# Altium schematic sheet EthIO_02B_MCU_PA_PB.SchDoc
size A4; SheetNumber: 4; SheetTotal: 7
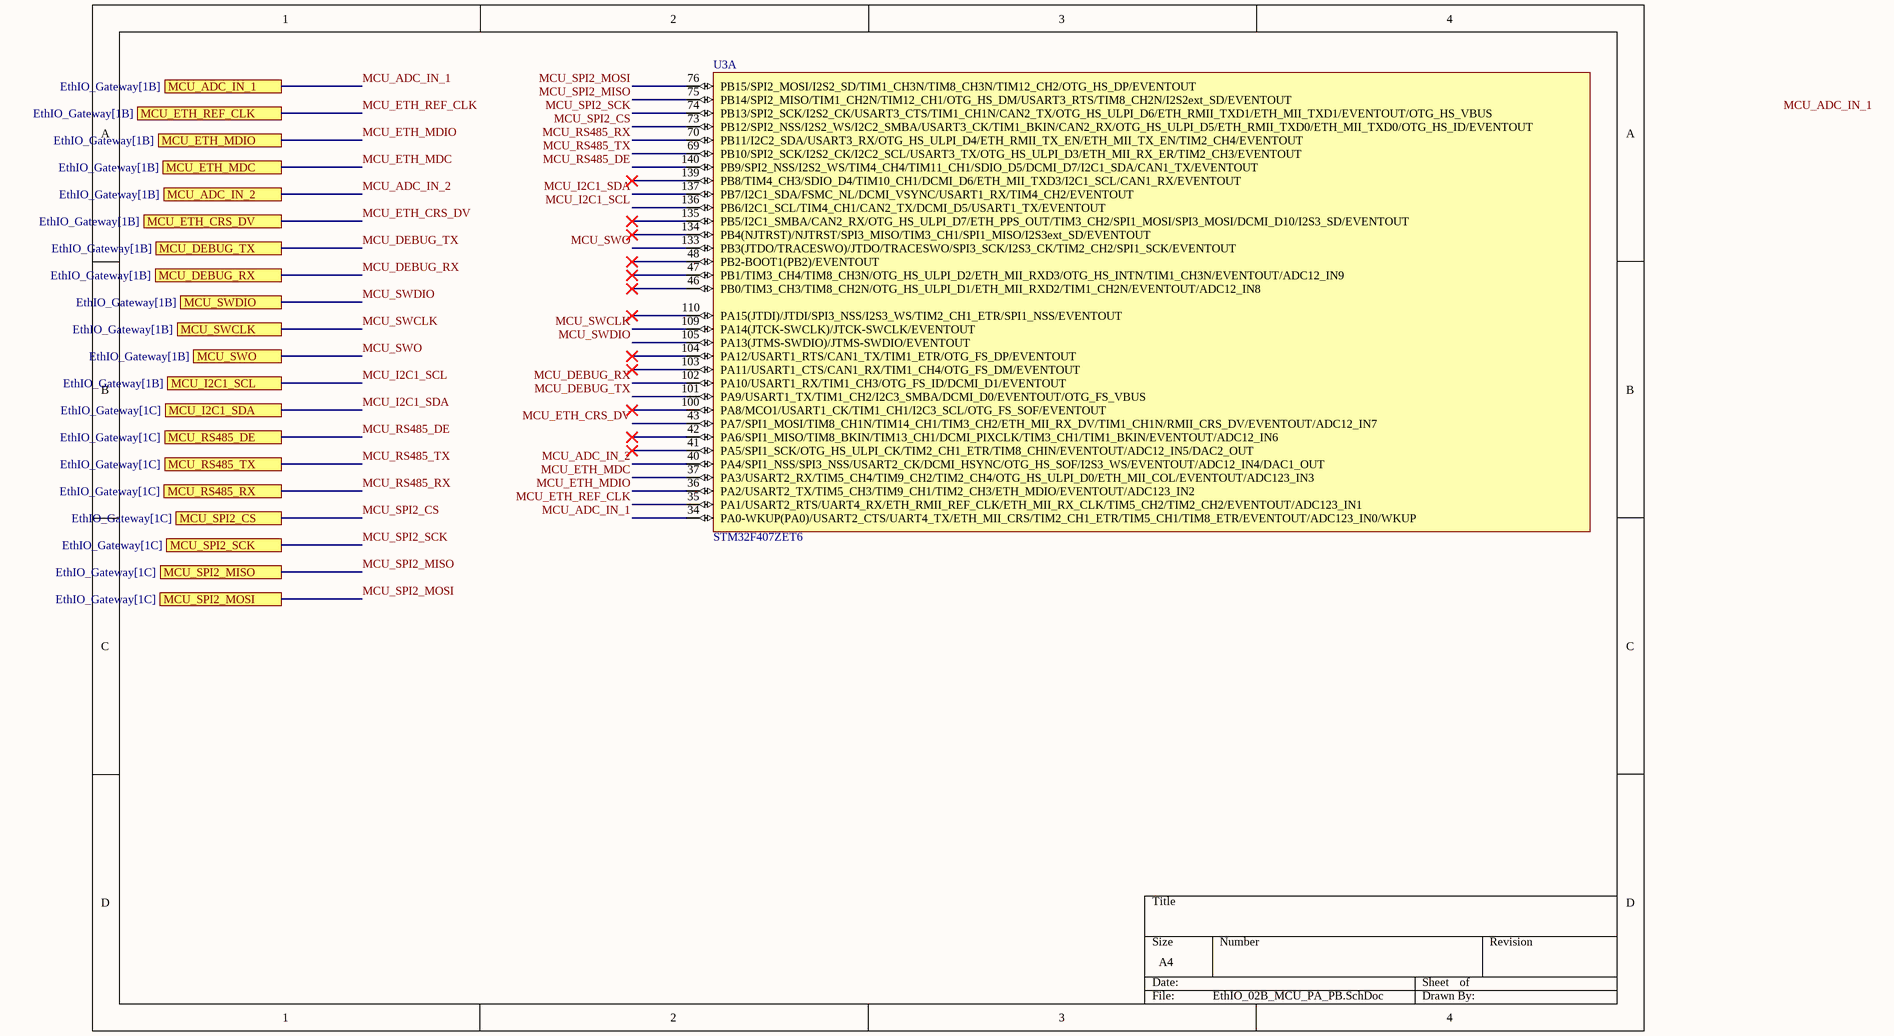
[diagram p0: EthIO_02B_MCU_PA_PB.SchDoc]

## Parts
U3  STM32F407ZET6  [TQFP144_V]  (part A of 5)

## Ports
MCU_ADC_IN_1 (see EthIO_Gateway[1B]), MCU_ADC_IN_2 (see EthIO_Gateway[1B]), MCU_DEBUG_RX (see EthIO_Gateway[1B]), MCU_DEBUG_TX (see EthIO_Gateway[1B]), MCU_ETH_CRS_DV (see EthIO_Gateway[1B]), MCU_ETH_MDC (see EthIO_Gateway[1B]), MCU_ETH_MDIO (see EthIO_Gateway[1B]), MCU_ETH_REF_CLK (see EthIO_Gateway[1B]), MCU_I2C1_SCL (see EthIO_Gateway[1B]), MCU_I2C1_SDA (see EthIO_Gateway[1C]), MCU_RS485_DE (see EthIO_Gateway[1C]), MCU_RS485_RX (see EthIO_Gateway[1C]), MCU_RS485_TX (see EthIO_Gateway[1C]), MCU_SPI2_CS (see EthIO_Gateway[1C]), MCU_SPI2_MISO (see EthIO_Gateway[1C]), MCU_SPI2_MOSI (see EthIO_Gateway[1C]), MCU_SPI2_SCK (see EthIO_Gateway[1C]), MCU_SWCLK (see EthIO_Gateway[1B]), MCU_SWDIO (see EthIO_Gateway[1B]), MCU_SWO (see EthIO_Gateway[1B])

## Nets
MCU_ADC_IN_1: U3.34(PA0-WKUP(PA0)/USART2_CTS/UART4_TX/ETH_MII_CRS/TIM2_CH1_ETR/TIM5_CH1/TIM8_ETR/EVENTOUT/ADC123_IN0/WKUP) ; port MCU_ADC_IN_1
MCU_ADC_IN_2: U3.40(PA4/SPI1_NSS/SPI3_NSS/USART2_CK/DCMI_HSYNC/OTG_HS_SOF/I2S3_WS/EVENTOUT/ADC12_IN4/DAC1_OUT) ; port MCU_ADC_IN_2
MCU_DEBUG_RX: U3.102(PA10/USART1_RX/TIM1_CH3/OTG_FS_ID/DCMI_D1/EVENTOUT) ; port MCU_DEBUG_RX
MCU_DEBUG_TX: U3.101(PA9/USART1_TX/TIM1_CH2/I2C3_SMBA/DCMI_D0/EVENTOUT/OTG_FS_VBUS) ; port MCU_DEBUG_TX
MCU_ETH_CRS_DV: U3.43(PA7/SPI1_MOSI/TIM8_CH1N/TIM14_CH1/TIM3_CH2/ETH_MII_RX_DV/TIM1_CH1N/RMII_CRS_DV/EVENTOUT/ADC12_IN7) ; port MCU_ETH_CRS_DV
MCU_ETH_MDC: U3.37(PA3/USART2_RX/TIM5_CH4/TIM9_CH2/TIM2_CH4/OTG_HS_ULPI_D0/ETH_MII_COL/EVENTOUT/ADC123_IN3) ; port MCU_ETH_MDC
MCU_ETH_MDIO: U3.36(PA2/USART2_TX/TIM5_CH3/TIM9_CH1/TIM2_CH3/ETH_MDIO/EVENTOUT/ADC123_IN2) ; port MCU_ETH_MDIO
MCU_ETH_REF_CLK: U3.35(PA1/USART2_RTS/UART4_RX/ETH_RMII_REF_CLK/ETH_MII_RX_CLK/TIM5_CH2/TIM2_CH2/EVENTOUT/ADC123_IN1) ; port MCU_ETH_REF_CLK
MCU_I2C1_SCL: U3.136(PB6/I2C1_SCL/TIM4_CH1/CAN2_TX/DCMI_D5/USART1_TX/EVENTOUT) ; port MCU_I2C1_SCL
MCU_I2C1_SDA: U3.137(PB7/I2C1_SDA/FSMC_NL/DCMI_VSYNC/USART1_RX/TIM4_CH2/EVENTOUT) ; port MCU_I2C1_SDA
MCU_RS485_DE: U3.140(PB9/SPI2_NSS/I2S2_WS/TIM4_CH4/TIM11_CH1/SDIO_D5/DCMI_D7/I2C1_SDA/CAN1_TX/EVENTOUT) ; port MCU_RS485_DE
MCU_RS485_RX: U3.70(PB11/I2C2_SDA/USART3_RX/OTG_HS_ULPI_D4/ETH_RMII_TX_EN/ETH_MII_TX_EN/TIM2_CH4/EVENTOUT) ; port MCU_RS485_RX
MCU_RS485_TX: U3.69(PB10/SPI2_SCK/I2S2_CK/I2C2_SCL/USART3_TX/OTG_HS_ULPI_D3/ETH_MII_RX_ER/TIM2_CH3/EVENTOUT) ; port MCU_RS485_TX
MCU_SPI2_CS: U3.73(PB12/SPI2_NSS/I2S2_WS/I2C2_SMBA/USART3_CK/TIM1_BKIN/CAN2_RX/OTG_HS_ULPI_D5/ETH_RMII_TXD0/ETH_MII_TXD0/OTG_HS_ID/EVENTOUT) ; port MCU_SPI2_CS
MCU_SPI2_MISO: U3.75(PB14/SPI2_MISO/TIM1_CH2N/TIM12_CH1/OTG_HS_DM/USART3_RTS/TIM8_CH2N/I2S2ext_SD/EVENTOUT) ; port MCU_SPI2_MISO
MCU_SPI2_MOSI: U3.76(PB15/SPI2_MOSI/I2S2_SD/TIM1_CH3N/TIM8_CH3N/TIM12_CH2/OTG_HS_DP/EVENTOUT) ; port MCU_SPI2_MOSI
MCU_SPI2_SCK: U3.74(PB13/SPI2_SCK/I2S2_CK/USART3_CTS/TIM1_CH1N/CAN2_TX/OTG_HS_ULPI_D6/ETH_RMII_TXD1/ETH_MII_TXD1/EVENTOUT/OTG_HS_VBUS) ; port MCU_SPI2_SCK
MCU_SWCLK: U3.109(PA14(JTCK-SWCLK)/JTCK-SWCLK/EVENTOUT) ; port MCU_SWCLK
MCU_SWDIO: U3.105(PA13(JTMS-SWDIO)/JTMS-SWDIO/EVENTOUT) ; port MCU_SWDIO
MCU_SWO: U3.133(PB3(JTDO/TRACESWO)/JTDO/TRACESWO/SPI3_SCK/I2S3_CK/TIM2_CH2/SPI1_SCK/EVENTOUT) ; port MCU_SWO

Not connected (* = marked no-connect by the designer): U3 41(PA5/SPI1_SCK/OTG_HS_ULPI_CK/TIM2_CH1_ETR/TIM8_CHIN/EVENTOUT/ADC12_IN5/DAC2_OUT)* 42(PA6/SPI1_MISO/TIM8_BKIN/TIM13_CH1/DCMI_PIXCLK/TIM3_CH1/TIM1_BKIN/EVENTOUT/ADC12_IN6)* 46(PB0/TIM3_CH3/TIM8_CH2N/OTG_HS_ULPI_D1/ETH_MII_RXD2/TIM1_CH2N/EVENTOUT/ADC12_IN8)* 47(PB1/TIM3_CH4/TIM8_CH3N/OTG_HS_ULPI_D2/ETH_MII_RXD3/OTG_HS_INTN/TIM1_CH3N/EVENTOUT/ADC12_IN9)* 48(PB2-BOOT1(PB2)/EVENTOUT)* 100(PA8/MCO1/USART1_CK/TIM1_CH1/I2C3_SCL/OTG_FS_SOF/EVENTOUT)* 103(PA11/USART1_CTS/CAN1_RX/TIM1_CH4/OTG_FS_DM/EVENTOUT)* 104(PA12/USART1_RTS/CAN1_TX/TIM1_ETR/OTG_FS_DP/EVENTOUT)* 110(PA15(JTDI)/JTDI/SPI3_NSS/I2S3_WS/TIM2_CH1_ETR/SPI1_NSS/EVENTOUT)* 134(PB4(NJTRST)/NJTRST/SPI3_MISO/TIM3_CH1/SPI1_MISO/I2S3ext_SD/EVENTOUT)* 135(PB5/I2C1_SMBA/CAN2_RX/OTG_HS_ULPI_D7/ETH_PPS_OUT/TIM3_CH2/SPI1_MOSI/SPI3_MOSI/DCMI_D10/I2S3_SD/EVENTOUT)* 139(PB8/TIM4_CH3/SDIO_D4/TIM10_CH1/DCMI_D6/ETH_MII_TXD3/I2C1_SCL/CAN1_RX/EVENTOUT)*

## Notes on the sheet
- Labels drawn without touching a wire or pin: MCU_ADC_IN_1

## Library data of the parts
U3 = STM32F407ZET6: ARM Cortex-M4 32b MCU+FPU, 210DMIP, 512 kB Flash, 192+4 kB RAM, Camera, 114 I/Os, 144-pin LQFP, -40 to +85癈, Tray; Internal RAM: 192kB; Operating Frequency (Processor Speed): 168MHz; A/D Converter: 24x12-bit; D/A Converter: 2x12-bit; 16-bit Timers (IC/OC/PWM): 12x16-bit(24/24/30); 32-bit Timer (IC/OC/PWM): 2x32-bit (8/8/8); Other Timer Functions: 2xWDG, RTC, 24-bit down counter; Serial Interface: 3xSPI/2xI2S/2xI2C/3xUSART(IrDa, ISO7816)/3xUART/2xUSB OTG FS/HS, 2xCAN/Ethernet MAC10/100, SDIO; 联系卖家，免费查找封装: 唯一出售店铺网址https://shop463601444.taobao.com; DatasheetVersion: rev2, Jan-2012; PackageVersion: 2012; PackageReference: TQFP144; PackageDescription: 144-Pin Low Profile Quad Flat Package, 20x20 mm Body, 0.5 mm Pitch; ComponentLink1Description: Manufacturer URL; ComponentLink1URL: http://www.st.com/; ComponentLink2Description: STM32F405/7 Datasheet; ComponentLink2URL: http://www.st.com/internet/com/TECHNICAL_RESOURCES/TECHNICAL_LITERATURE/DATASHEET/DM00037051.pdf; ComponentLink3Description: STM32F4 Web Page; ComponentLink3URL: http://www.st.com/internet/mcu/subclass/1521.jsp